# Altium schematic sheet Morpheus.SchDoc: Sanhaço - Morpheus
size A4; DocumentNumber: CB05; Revision: 1.1; SheetNumber: 5; SheetTotal: 5
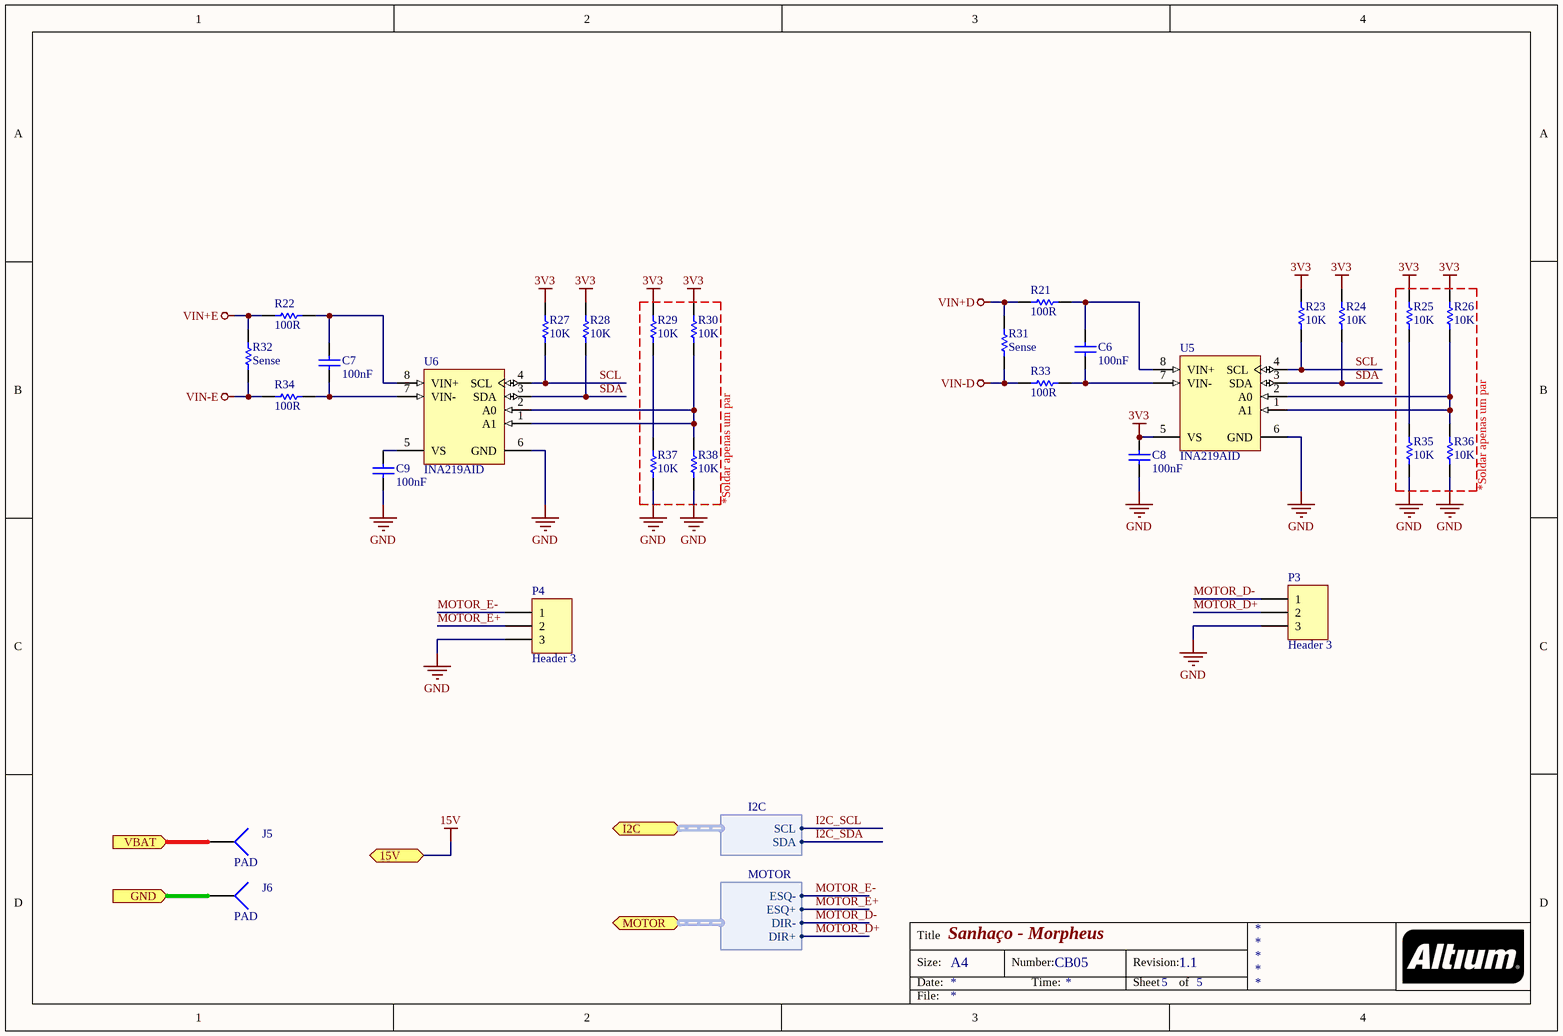
[diagram p0: Morpheus.SchDoc]

## Parts
C6  100nF  [CAPC0805(2012)145_N]
C7  100nF  [CAPC0805(2012)145_N]
C8  100nF  [CAPC0805(2012)145_N]
C9  100nF  [CAPC0805(2012)145_N]
J5  PAD  [PIN1]
J6  PAD  [PIN1]
P3  Header 3  [HDR1X3]
P4  Header 3  [HDR1X3]
R21  100R  [RESC0402(1005)_L]
R22  100R  [RESC0402(1005)_L]
R23  10K  [RESC0402(1005)_L]
R24  10K  [RESC0402(1005)_L]
R25  10K  [RESC0402(1005)_L]
R26  10K  [RESC0402(1005)_L]
R27  10K  [RESC0402(1005)_L]
R28  10K  [RESC0402(1005)_L]
R29  10K  [RESC0402(1005)_L]
R30  10K  [RESC0402(1005)_L]
R31  Sense  [RESC6432X89X76ML25T25]
R32  Sense  [RESC6432X89X76ML25T25]
R33  100R  [RESC0402(1005)_L]
R34  100R  [RESC0402(1005)_L]
R35  10K  [RESC0402(1005)_L]
R36  10K  [RESC0402(1005)_L]
R37  10K  [RESC0402(1005)_L]
R38  10K  [RESC0402(1005)_L]
U5  INA219AID  [D0008A_N]
U6  INA219AID  [D0008A_N]

## Ports
15V, GND (in), I2C (harness I2C), MOTOR (harness MOTOR), VBAT (in)

## Harnesses
I2C: SCL, SDA
MOTOR: ESQ+, DIR-, DIR+, ESQ-

## Nets
3V3: C8.2 R23.1 R24.1 R25.1 R26.1 R27.1 R28.1 R29.1 R30.1 U5.5(VS)
15V: port 15V
GND: C8.1 C9.1 P3.3 P4.3 R35.2 R36.2 R37.2 R38.2 U5.6(GND) U6.6(GND)
VIN+D: R21.2 R31.2
VIN+E: R22.2 R32.2
VIN-D: R31.1 R33.2
VIN-E: R32.1 R34.2
GND: J6.1 ; port GND  [a separate net that carries the same name]
I2C_SCL: port I2C.SCL
I2C_SDA: port I2C.SDA
MOTOR_D+: P3.2 ; port MOTOR.DIR+
MOTOR_D-: P3.1 ; port MOTOR.DIR-
MOTOR_E+: P4.2 ; port MOTOR.ESQ+
MOTOR_E-: P4.1 ; port MOTOR.ESQ-
SCL: R23.2 R27.2 U5.4(SCL) U6.4(SCL)
SDA: R24.2 R28.2 U5.3(SDA) U6.3(SDA)
VBAT: J5.1 ; port VBAT
NetC6_1: C6.1 R21.1 U5.8(VIN+)
NetC6_2: C6.2 R33.1 U5.7(VIN-)
NetC7_1: C7.1 R22.1 U6.8(VIN+)
NetC7_2: C7.2 R34.1 U6.7(VIN-)
NetC9_2: C9.2 U6.5(VS)
NetR25_2: R25.2 R35.1
NetR26_2: R26.2 R36.1 U5.1(A1) U5.2(A0)
NetR29_2: R29.2 R37.1
NetR30_2: R30.2 R38.1 U6.1(A1) U6.2(A0)

## Notes on the sheet
- *Soldar apenas um par
- Title
- Size:
- Date:
- A4
- Number:
- Time:
- Revision:
- Sheet
- of
- File:

## Library data of the parts
C6-C9 = CMP-1036-04417-1: CAP 100nF 50V ±5% 0805 (2012 Metric) Thickness 1.45mm SMD; Case-Metric: 2012; Tolerance: Â±5%; Case-EIA: 0805; Max Thickness: 1.45 mm; Rated Voltage: 50 V; Value: 100nF; Technology: SMT
J5 J6 = Socket: LatestRevisionDate: 17-Jul-2002; LatestRevisionNote: Re-released for DXP Platform.; Publisher: Altium Limited
P3 P4 = Header 3: Header, 3-Pin; LatestRevisionDate: 17-Jul-2002; LatestRevisionNote: Re-released for DXP Platform.; Publisher: Altium Limited
R21 R22 R33 R34 = CMP-1011-00050-1: 100R 0.063W 5% 0402 (1005 Metric)  SMD; Value: 100.00 Ohm; Case-Metric: 1005; Case-EIA: 0402; Power: 0.063 W; Technology: SMT; Tolerance: 5 %
R23-R25 R27-R29 R35 R37 = CMP-1011-00623-1: 10K 0.063W 1% 0402 (1005 Metric)  SMD                                      71-CRCW040210K0FKEDC; Case-Metric: 1005; Value: 10000.00 Ohm; Case-EIA: 0402; Tolerance: 1 %; Technology: SMT; Power: 0.063 W
R26 R30 R36 R38 = CMP-1011-00623-1: 10K 0.063W 1% 0402 (1005 Metric)  SMD                                 71-CRCW040210K0FKEDC; Case-Metric: 1005; Value: 10000.00 Ohm; Case-EIA: 0402; Tolerance: 1 %; Technology: SMT; Power: 0.063 W
R31 R32 = CMP-2000-07419-1: Chip Resistor, 9 mOhm, +/- 1%, 1 W, -65 to 170 degC, 2512 (6432 Metric), RoHS, Tape and Reel                        71-WSLF25121L000FEA; Manufacturer: Vishay; Case Height: 0.635mm; Resistance: 0.009Ohms; Case Width: 3.2mm; Case Length: 6.4mm; Brand: Vishay/Dale; Power Rating: 6W; Temperature Coefficient: 75PPM/C; Series: WSL; Package / Case: 2512(6432metric); Package Reference: 2512; Type: PowerMetalStripResistors,LowValue(downto0.0005Ohms),SurfaceMount; Termination Style: SMD/SMT; Case Code - mm: 6432; Case Code - in: 2512; Factory Pack Quantity: 2000; Operating Temperature Range: -65Cto+170C; Tolerance: 1%; Packaging: Reel; Datasheet URL: http://www.vishay.com/docs/30100/wsl.pdf; Package Description: 2-Pin Surface Mount Device, Body 6.35 x 3.18 mm; Manufacturer URL: http://www.vishay.com/; Datasheet Version: 07/2016; RoHS: Details; Product: MetalElementCurrentSensingResistors; Mounting Technology: SurfaceMount; Product Category: CurrentSenseResistors-SMD
U5 U6 = CMP-0704-00006-2: Zero-Drift, Bi-Directional Current / Power Monitor, 3 to 5.5 V, -40 to 125 degC, 8-pin SOIC (D8), Green (RoHS & no Sb/Br); Manufacturer: Texas Instruments; Vs(Max)(V): 5.5; Rating: Catalog; Gain(V/V): 1, 0.5, 0.25, 0.125; Vs(Min)(V): 3; Common Mode Range(Max)(V): 26; Input Offset (+/-)(Max)(uV): 100; Small-Signal Bandwidth(Typ)(MHz): 0.011; SubFamily: Current Shunt Monitor; Common Mode Range(Min)(V): 0; Quiescent Current (+/-)(Typ)(mA): 0.7; PartNumber: INA219AID; ComponentLink2Description: Datasheet; PackageVersion: 4040047-3/M, 06/2011; ComponentLink3Description: Package Specification; Mounting Technology: Surface Mount; ComponentLink2URL: http://www.ti.com/general/docs/lit/getliterature.tsp?genericPartNumber=INA219&fileType=pdf; Eco-Plan: Green (RoHS & no Sb/Br); DatasheetVersion: SBOS448F; Code_JEDEC: MS-012; PackageDescription: 8-Pin Plastic Small Outline, Body 4.9 x 3.9 mm, Pitch 1.27 mm; ComponentLink1Description: Manufacturer URL; ComponentLink1URL: http://www.ti.com/; PackageReference: D0008A; ComponentLink3URL: http://www.ti.com/lit/ml/msoi002j/msoi002j.pdf; CMRR(Min)(dB): 100